# Altium schematic sheet Encodeurs.Schematic.SchDoc
size A
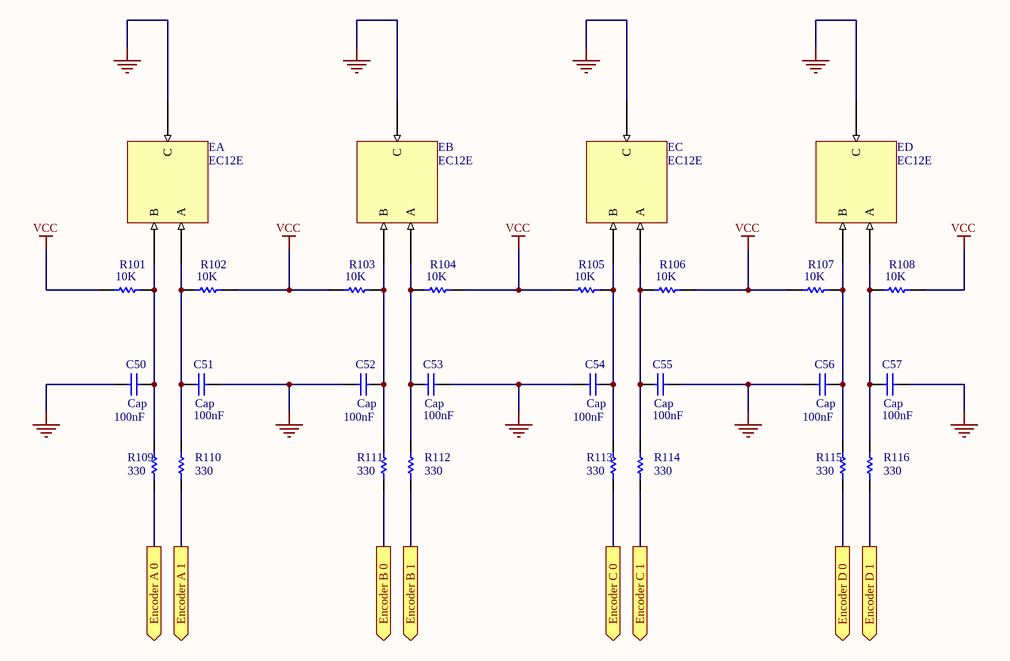
[diagram p0: Encodeurs.Schematic.SchDoc]

## Parts
C50  Cap  value 100nF  [CAPC1608N]
C51  Cap  value 100nF  [CAPC1608N]
C52  Cap  value 100nF  [CAPC1608N]
C53  Cap  value 100nF  [CAPC1608N]
C54  Cap  value 100nF  [CAPC1608N]
C55  Cap  value 100nF  [CAPC1608N]
C56  Cap  value 100nF  [CAPC1608N]
C57  Cap  value 100nF  [CAPC1608N]
EA  EC12E  [EC12E]
EB  EC12E  [EC12E]
EC  EC12E  [EC12E]
ED  EC12E  [EC12E]
R101  10K  [CAPC1608N]
R102  10K  [CAPC1608N]
R103  10K  [CAPC1608N]
R104  10K  [CAPC1608N]
R105  10K  [CAPC1608N]
R106  10K  [CAPC1608N]
R107  10K  [CAPC1608N]
R108  10K  [CAPC1608N]
R109  330  [CAPC1608N]
R110  330  [CAPC1608N]
R111  330  [CAPC1608N]
R112  330  [CAPC1608N]
R113  330  [CAPC1608N]
R114  330  [CAPC1608N]
R115  330  [CAPC1608N]
R116  330  [CAPC1608N]

## Ports
Encoder A 0 (out), Encoder A 1 (out), Encoder B 0 (out), Encoder B 1 (out), Encoder C 0 (out), Encoder C 1 (out), Encoder D 0 (out), Encoder D 1 (out)

## Nets
GND: C50.1 C51.1 C52.1 C53.1 C54.1 C55.1 C56.1 C57.1 EA.3(C) EB.3(C) EC.3(C) ED.3(C)
VCC: R101.1 R102.2 R103.1 R104.2 R105.1 R106.2 R107.1 R108.2
Encoder A 0: R109.1 ; port Encoder A 0
Encoder A 1: R110.1 ; port Encoder A 1
Encoder B 0: R111.1 ; port Encoder B 0
Encoder B 1: R112.1 ; port Encoder B 1
Encoder C 0: R113.1 ; port Encoder C 0
Encoder C 1: R114.1 ; port Encoder C 1
Encoder D 0: R115.1 ; port Encoder D 0
Encoder D 1: R116.1 ; port Encoder D 1
NetC50_2: C50.2 EA.2(B) R101.2 R109.2
NetC51_2: C51.2 EA.1(A) R102.1 R110.2
NetC52_2: C52.2 EB.2(B) R103.2 R111.2
NetC53_2: C53.2 EB.1(A) R104.1 R112.2
NetC54_2: C54.2 EC.2(B) R105.2 R113.2
NetC55_2: C55.2 EC.1(A) R106.1 R114.2
NetC56_2: C56.2 ED.2(B) R107.2 R115.2
NetC57_2: C57.2 ED.1(A) R108.1 R116.2

## Library data of the parts
C50-C57 = Cap: Capacitor; Published: 8-Jun-2000; LatestRevisionDate: 17-Jul-2002; LatestRevisionNote: Re-released for DXP Platform.; PackageReference: RAD-0.3; Publisher: Altium Limited; PackageDescription: Radial Cap, Thru-Hole; 2 Leads; 0.3 in Pin Spacing
R101-R108 = Res1: Resistor; Published: 8-Jun-2000; LatestRevisionDate: 17-Jul-2002; LatestRevisionNote: Re-released for DXP Platform.; PackageReference: AXIAL-0.3; Publisher: Altium Limited; PackageDescription: Axial Device, Thru-Hole; 2 Leads; 0.3 in Pin Spacing; Value: 10K
R109-R116 = Res1: Resistor; Value: 330R; Published: 8-Jun-2000; LatestRevisionDate: 17-Jul-2002; LatestRevisionNote: Re-released for DXP Platform.; PackageReference: AXIAL-0.3; Publisher: Altium Limited; PackageDescription: Axial Device, Thru-Hole; 2 Leads; 0.3 in Pin Spacing